# Altium schematic sheet Main.SchDoc
size A; SheetNumber: 1; SheetTotal: 1
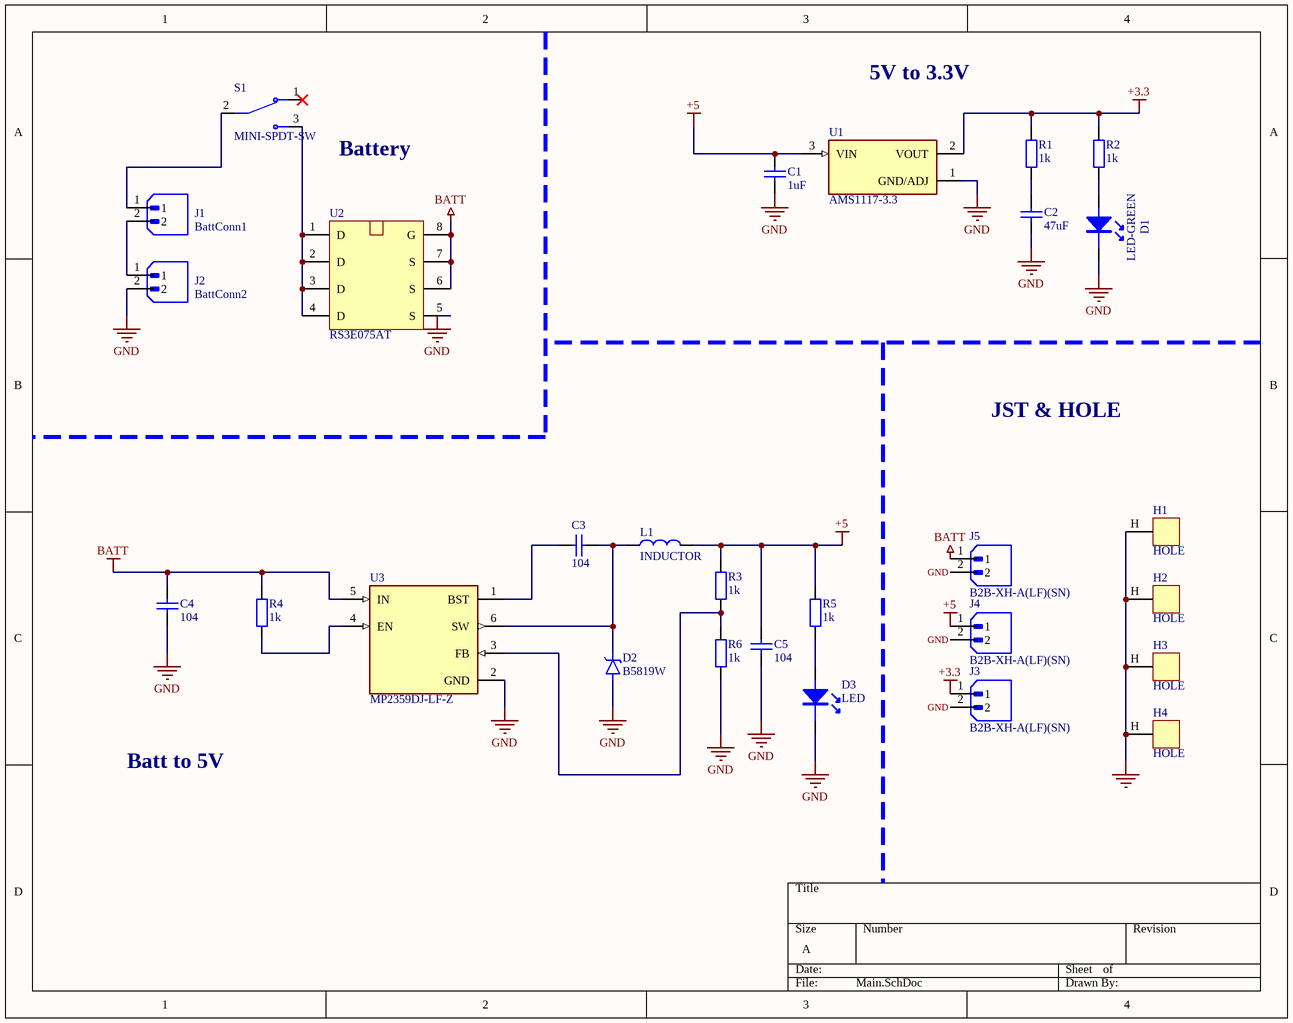
[diagram p0: Main.SchDoc]

## Parts
C1  1uF  [CAP_0805]
C2  47uF  [CAP_0805]
C3  104  [0805 CAP]
C4  104  [0805 CAP]
C5  104  [0805 CAP]
D1  LED-GREEN  [LED SMD 0805]
D2  B5819W  [SOD-123]
D3  LED  [LED SMD 0805]
H1  HOLE  [HOLE]
H2  HOLE  [HOLE]
H3  HOLE  [HOLE]
H4  HOLE  [HOLE]
J1  BattConn1  [JST_B2B-XH-A(LF)(SN)]
J2  BattConn2  [JST_B2B-XH-A(LF)(SN)]
J3  B2B-XH-A(LF)(SN)  [JST_B2B-XH-A(LF)(SN)]
J4  B2B-XH-A(LF)(SN)  [JST_B2B-XH-A(LF)(SN)]
J5  B2B-XH-A(LF)(SN)  [JST_B2B-XH-A(LF)(SN)]
L1  INDUCTOR  [INDUCTOR 0805]
R1  1k  [RES_0805]
R2  1k  [RES_0805]
R3  1k  [RES_0805]
R4  1k  [RES_0805]
R5  1k  [RES_0805]
R6  1k  [RES_0805]
S1  MINI-SPDT-SW  [SW_MINI-SPDT-SW]
U1  AMS1117-3.3  [SOT229P700X180-4N]
U2  RS3E075AT  [SOIC 8PIN]
U3  MP2359DJ-LF-Z  [SOT95P280X100-6N]

## Nets
+3.3: J3.1 R1.2 R2.2 U1.2(VOUT)
+5: C1.2 C5.2 J4.1 L1.2 R3.2 R5.2 U1.3(VIN)
BATT: C4.2 J5.1 R4.2 U2.6(S) U2.7(S) U2.8(G) U3.5(IN)
GND: C1.1 C2.1 C4.1 C5.1 D1.2 D2.A D3.2 H1.H(HOLE) H2.H(HOLE) H3.H(HOLE) H4.H(HOLE) J2.2 J3.2 J4.2 J5.2 R6.1 U1.1(GND/ADJ) U2.5(S) U3.2(GND)
NetC2_2: C2.2 R1.1
NetC3_1: C3.1 U3.1(BST)
NetC3_2: C3.2 D2.C L1.1 U3.6(SW)
NetD1_1: D1.1 R2.1
NetD3_1: D3.1 R5.1
NetJ1_1: J1.1 S1.2
NetJ1_2: J1.2 J2.1
NetR3_1: R3.1 R6.2 U3.3(FB)
NetR4_1: R4.1 U3.4(EN)
NetS1_3: S1.3 U2.1(D) U2.2(D) U2.3(D) U2.4(D)

Not connected (* = marked no-connect by the designer): S1 1*

## Notes on the sheet
- 5V to 3.3V
- Battery
- JST & HOLE
- Batt to 5V

## Library data of the parts
C1-C5 = CAP CERAMIC: Published: 8-Jun-2000; LatestRevisionDate: 17-Jul-2002; LatestRevisionNote: Re-released for DXP Platform.; PackageReference: RAD-0.3; Publisher: Altium Limited
D1 = LED
D2 = B5819W: MF: Taiwan Semiconductor; SnapEDA_Link: https://www.snapeda.com/parts/B5819W/Taiwan%20Semiconductor/view-part/105688/?ref=snap; MP: B5819W; Availability: Unavailable; Price: None; Value: *; Package: SOD-123 Taiwan Semiconductor
J1-J5 = B2B-XH-A(LF)(SN): Connector Header Through Hole 2 position 0.098 (2.50mm); MF: JST Sales; SnapEDA_Link: https://www.snapeda.com/parts/B2B-XH-A(LF)(SN)/JST/view-part/?ref=snap; Package: None; Value: *; MP: B2B-XH-A(LF)(SN); Check_prices: https://www.snapeda.com/parts/B2B-XH-A(LF)(SN)/JST/view-part/?ref=eda
R1-R6 = RESISTOR: Value: R1/4W - 1K
S1 = MINI-SPDT-SW: Simple breadboard friendly SPDT slide switch. Rated at 30V/200mA with operating force of 250 +/-100gf.; Availability: Unavailable; Package: None; MP: MINI-SPDT-SW; Value: *; Price: None
U1 = AMS1117-3.3: Sot223/Pkg 1-Amp 3.3-Volt Low Drop Out Voltage Regulatator; MF: Advanced Monolithic Systems; SnapEDA_Link: https://www.snapeda.com/parts/AMS1117-3.3/Advanced+Monolithic+Systems/view-part/?ref=snap; Package: SOT-223 Seeed Technology; Value: *; MP: AMS1117-3.3; Check_prices: https://www.snapeda.com/parts/AMS1117-3.3/Advanced+Monolithic+Systems/view-part/?ref=eda
U2 = L7660
U3 = MP2359DJ-LF-Z: Buck Switching Regulator IC Positive Adjustable 0.81V 1 Output 1.2A SOT-23-6 Thin, TSOT-23-6; MF: Monolithic Power; SnapEDA_Link: https://www.snapeda.com/parts/MP2359DJ-LF-Z/Monolithic+Power+Systems+Inc./view-part/?ref=snap; Package: TSOT-23-6 Monolithic Power Systems; Value: *; MP: MP2359DJ-LF-Z; Check_prices: https://www.snapeda.com/parts/MP2359DJ-LF-Z/Monolithic+Power+Systems+Inc./view-part/?ref=eda